# Altium schematic sheet ldr.SchDoc
size A4; SheetNumber: 6; SheetTotal: 8
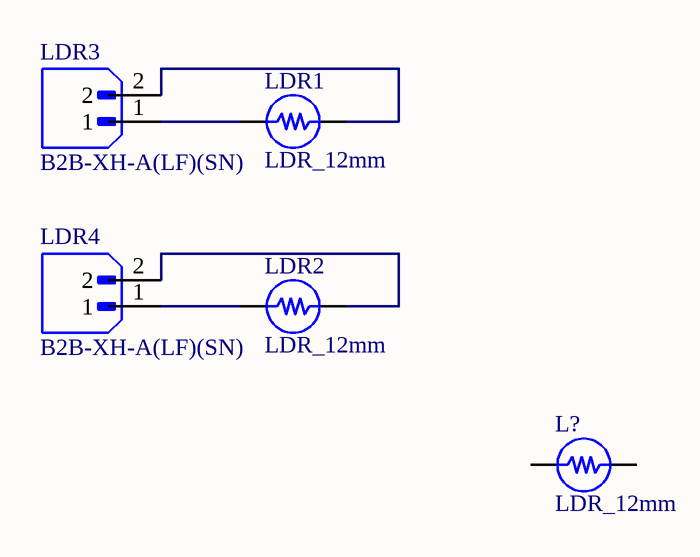
[diagram p0: ldr.SchDoc]

## Parts
L?  LDR_12mm  [LDR_12mm-Footprint-1]
LDR1  LDR_12mm  [LDR_12mm-Footprint-1]
LDR2  LDR_12mm  [LDR_12mm-Footprint-1]
LDR3  B2B-XH-A(LF)(SN)  [JST_B2B-XH-A(LF)(SN)]
LDR4  B2B-XH-A(LF)(SN)  [JST_B2B-XH-A(LF)(SN)]

## Nets
NetLDR1_1: LDR1.1 LDR3.1
NetLDR1_2: LDR1.2 LDR3.2
NetLDR2_1: LDR2.1 LDR4.1
NetLDR2_2: LDR2.2 LDR4.2

Not connected (* = marked no-connect by the designer): L? 1 2

## Library data of the parts
L? LDR1 LDR2 = CMP-00057-1: 12mm Light Dependant Resistor
LDR3 LDR4 = CMP-332-000000-1: Connector Header Through Hole 2 position 0.098 (2.50mm); MF: JST Sales America Inc.; Component Type: Standard; Value: *; Check_prices: https://www.snapeda.com/parts/B2B-XH-A(LF)(SN)/JST+Sales+America+Inc./view-part/?ref=eda; Package: None; MP: B2B-XH-A(LF)(SN); SnapEDA_Link: https://www.snapeda.com/parts/B2B-XH-A(LF)(SN)/JST+Sales+America+Inc./view-part/?ref=snap; Pin Count: 2; Source: B2B-XH-A(LF)(SN).SchLib; Design Item ID: B2B-XH-A(LF)(SN)